# Altium schematic sheet UNITED.SchDoc
size A1
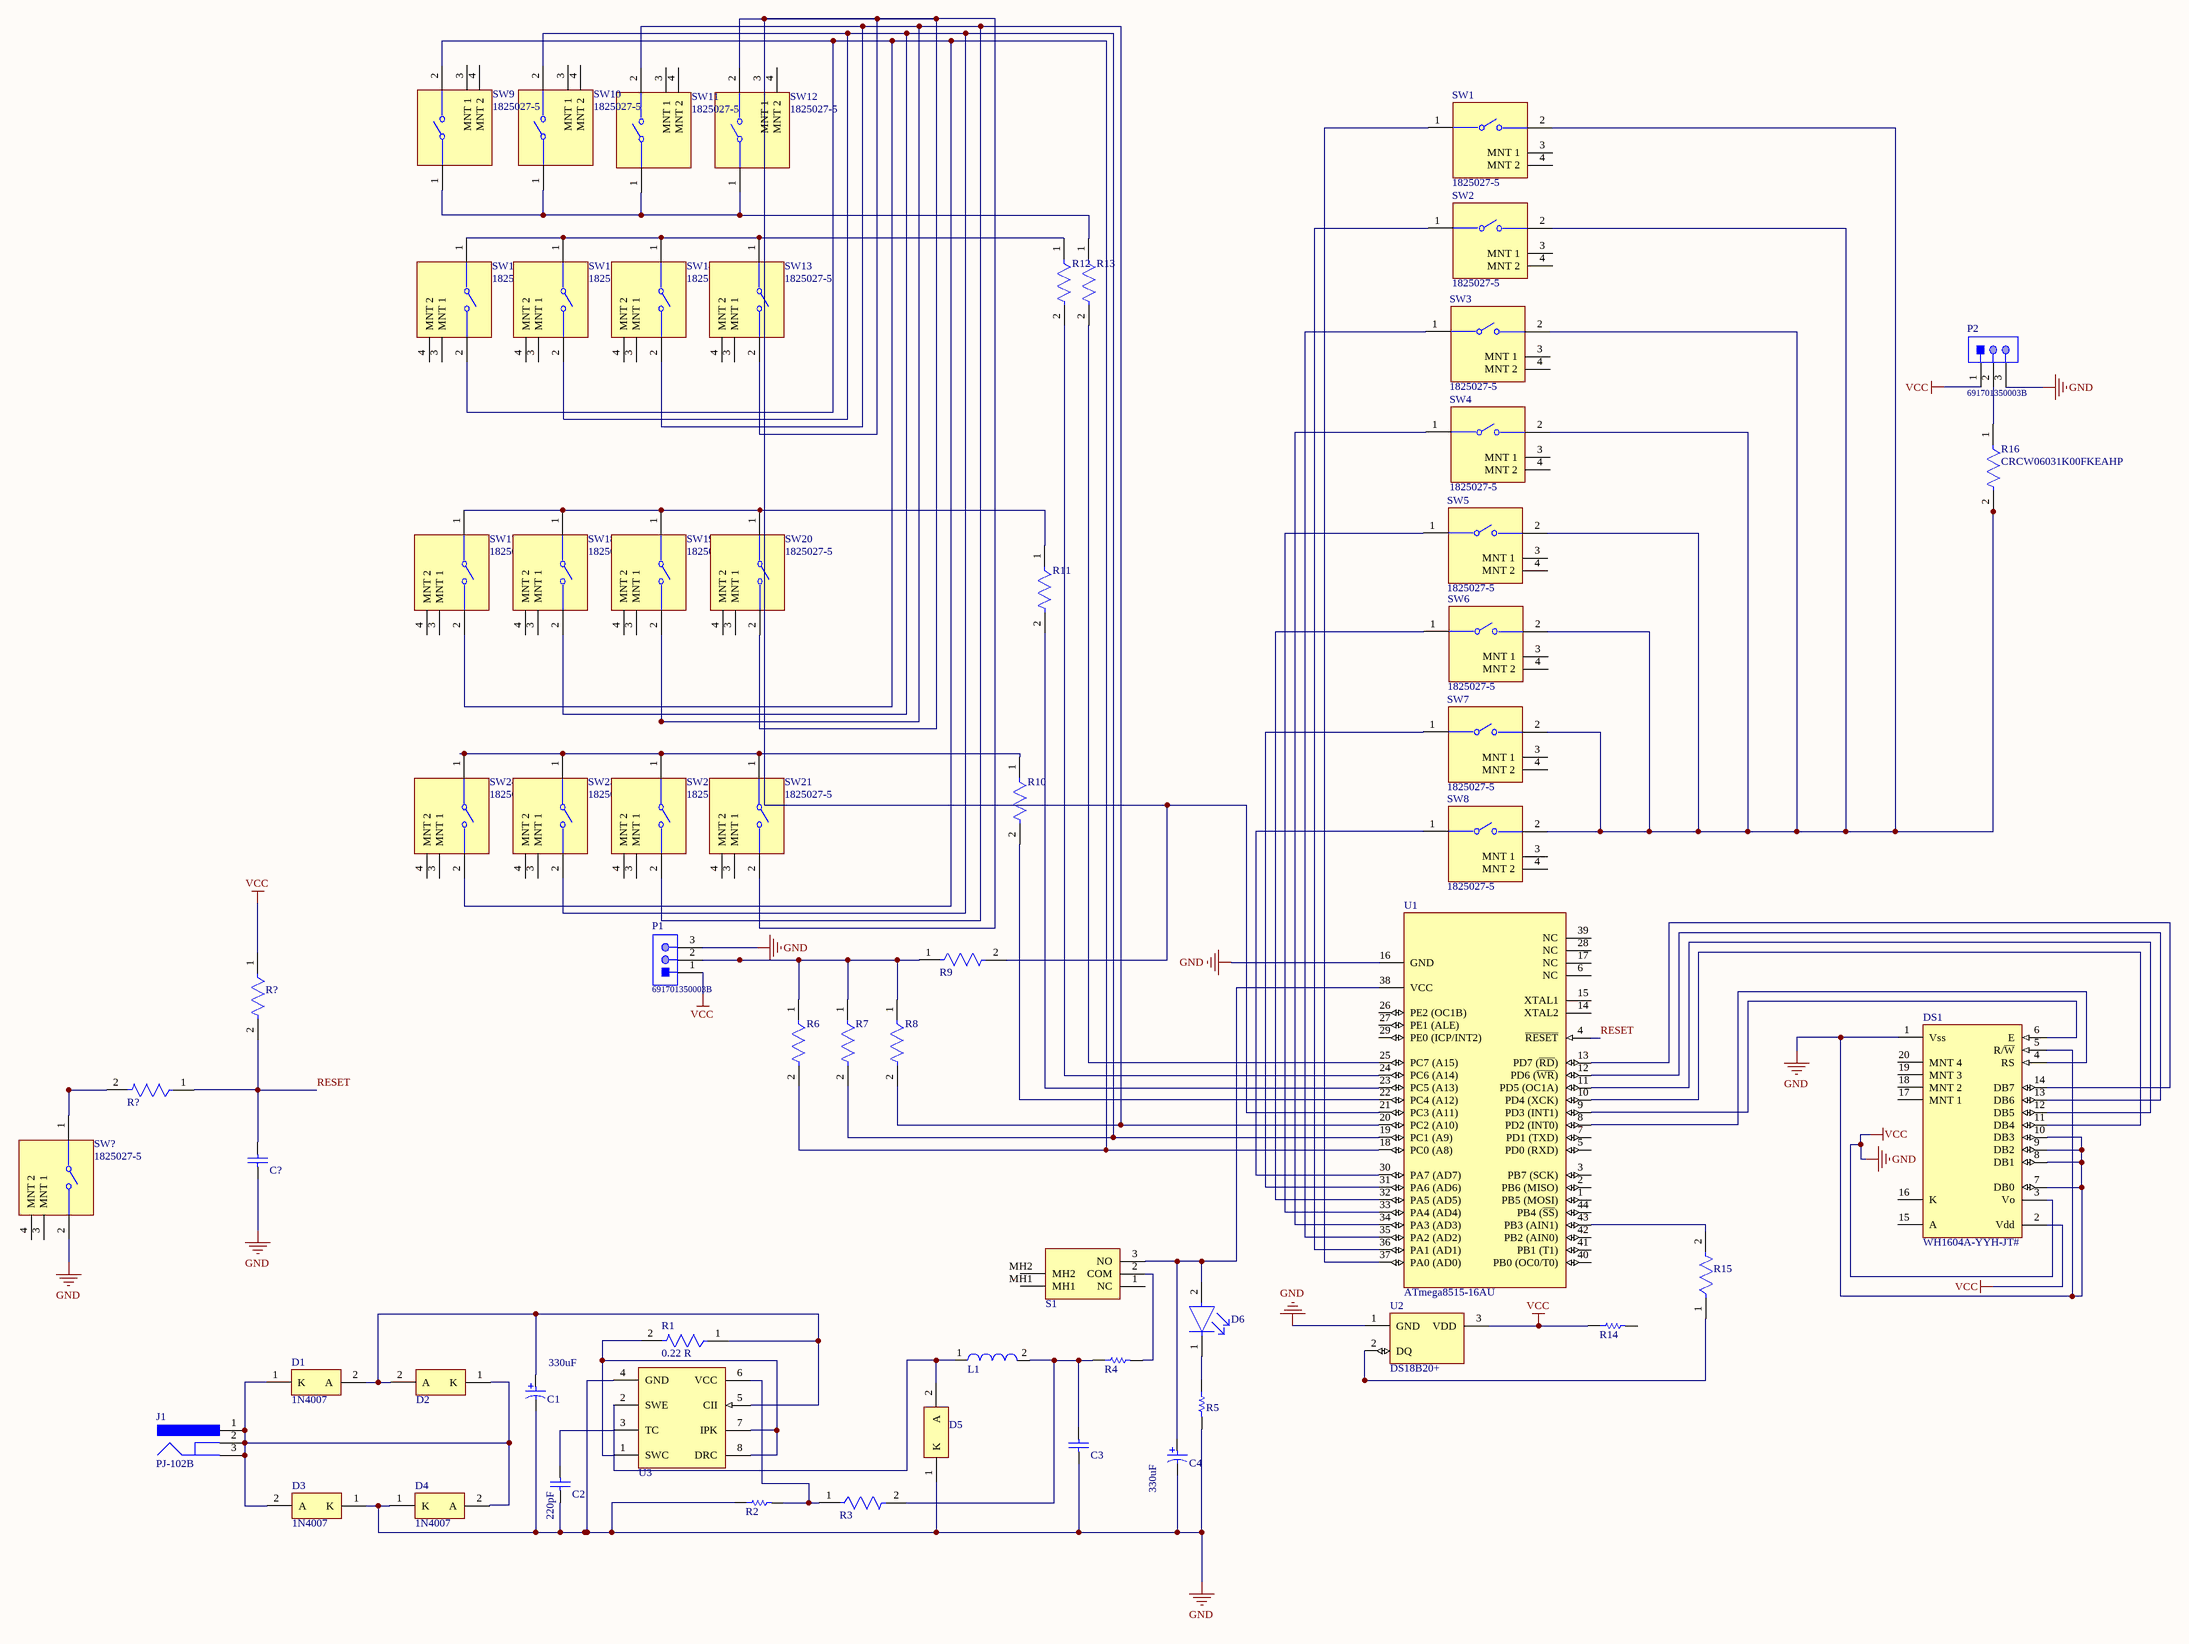
[diagram p0: UNITED.SchDoc]

## Parts
(Parts that share a designator on the sheet are numbered #1, #2 ... from top to bottom, then left to right.)
C1  EEE-FK1V331P  [PNSC-EEE-FK1V331P_L]  (value not drawn)
C2  VJ0603D201KXAAJ  [CAPC1608X92X38LL15T08]  (value not drawn)
C3  GRM188R60J106ME47D  [CAPC1608X90X35NL10T15]  (value not drawn)
C4  EEE-FK1V331P  [PNSC-EEE-FK1V331P_L]  (value not drawn)
C?  GRM188R60J106ME47D  [CAPC1608X90X35NL10T15]  (value not drawn)
D1  1N4007  [ONSC-AXIAL_LEAD-2-59-10_P]
D2  1N4007  [ONSC-AXIAL_LEAD-2-59-10_P]  (value not drawn)
D3  1N4007  [ONSC-AXIAL_LEAD-2-59-10_P]
D4  1N4007  [ONSC-AXIAL_LEAD-2-59-10_P]
D5  MBRS140T3G  [ONSC-SMB-2-403A-03_H_V]  (value not drawn)
D6  LTST-C190GKT  [FP-LTST-C190GKT-MFG]  (value not drawn)
DS1  WH1604A-YYH-JT#  [FP-WH1604A-YYH-JT#-MFG]
J1  PJ-102B  [CUI-PJ-102B_V]
L1  744774222  [WE-PD2-M]  (value not drawn)
P1  691701350003B  [691701350003B]
P2  691701350003B  [691701350003B]
R1  Resistance: 0.22 R  [FP-CRCW0402-e3-IPC_C]  (hidden comment: CRCW04022K70FKED)
R2  CRCW08051K00FKEA  [RESC2013X50X30NL20T20]  (value not drawn)
R3  CRCW06033K00FKEA  [FP-CRCW0603-e3-MFG]  (value not drawn)
R4  Jumper 2512(6432)  [RESC2512(6432)_L]  (value not drawn)
R5  RC0402FR-072K2L  [RESC1005X40X25NL05T10]  (value not drawn)
R6  CRCW06031K00FKEAHP  [FP-CRCW0603-HPe3-MFG]  (value not drawn)
R7  CRCW06031K00FKEAHP  [FP-CRCW0603-HPe3-MFG]  (value not drawn)
R8  CRCW06031K00FKEAHP  [FP-CRCW0603-HPe3-MFG]  (value not drawn)
R9  CRCW06031K00FKEAHP  [FP-CRCW0603-HPe3-MFG]  (value not drawn)
R10  CRCW06031K00FKEAHP  [FP-CRCW0603-HPe3-MFG]  (value not drawn)
R11  CRCW06031K00FKEAHP  [FP-CRCW0603-HPe3-MFG]  (value not drawn)
R12  CRCW06031K00FKEAHP  [FP-CRCW0603-HPe3-MFG]  (value not drawn)
R13  CRCW06031K00FKEAHP  [FP-CRCW0603-HPe3-MFG]  (value not drawn)
R14  CRCW08051K00FKEA  [RESC2013X50X30NL20T20]  (value not drawn)
R15  CRCW08050000Z0EAHP  [FP-CRCW0805-HPe3-IPC_A]  (value not drawn)
R16  CRCW06031K00FKEAHP  [FP-CRCW0603-HPe3-MFG]
R?#1  CRCW06031K00FKEAHP  [FP-CRCW0603-HPe3-MFG]  (value not drawn)
R?#2  CRCW06031K00FKEAHP  [FP-CRCW0603-HPe3-MFG]  (value not drawn)
S1  MS12ASW40  [MS12ASW40]  (value not drawn)
SW1  1825027-5  [FP-1825027-5-0]
SW2  1825027-5  [FP-1825027-5-0]
SW3  1825027-5  [FP-1825027-5-0]
SW4  1825027-5  [FP-1825027-5-0]
SW5  1825027-5  [FP-1825027-5-0]
SW6  1825027-5  [FP-1825027-5-0]
SW7  1825027-5  [FP-1825027-5-0]
SW8  1825027-5  [FP-1825027-5-0]
SW9  1825027-5  [FP-1825027-5-0]
SW10  1825027-5  [FP-1825027-5-0]
SW11  1825027-5  [FP-1825027-5-0]
SW12  1825027-5  [FP-1825027-5-0]
SW13  1825027-5  [FP-1825027-5-0]
SW14  1825027-5  [FP-1825027-5-0]
SW15  1825027-5  [FP-1825027-5-0]
SW16  1825027-5  [FP-1825027-5-0]
SW17  1825027-5  [FP-1825027-5-0]
SW18  1825027-5  [FP-1825027-5-0]
SW19  1825027-5  [FP-1825027-5-0]
SW20  1825027-5  [FP-1825027-5-0]
SW21  1825027-5  [FP-1825027-5-0]
SW22  1825027-5  [FP-1825027-5-0]
SW23  1825027-5  [FP-1825027-5-0]
SW24  1825027-5  [FP-1825027-5-0]
SW?  1825027-5  [FP-1825027-5-0]
U1  ATmega8515-16AU  [44A_N]
U2  DS18B20+  [Q3+1]
U3  MC34063ACD-TR  [SO8_M]  (value not drawn)

## Nets
GND: C1.2 C2.1 C3.1 C4.2 C?.1 D3.1(K) D4.1(K) D5.1(K) DS1.1(Vss) DS1.2(Vdd) DS1.3(Vo) DS1.5(R/~{W}) DS1.7(DB0) DS1.8(DB1) DS1.9(DB2) DS1.10(DB3) P1.1 P1.3 P2.1 P2.3 R2.1 R5.2 R14.1 R?#1.1 SW?.2 U1.16(GND) U2.1(GND) U2.3(VDD) U3.4(GND)  [also labelled VCC]
RESET: C?.2 R?#1.2 R?#2.1 U1.4(~{RESET})
NetC1_1: C1.1 D1.2(A) D2.2(A) R1.1 U3.5(CII)
NetC2_2: C2.2 U3.3(TC)
NetC3_2: C3.2 L1.2 R3.2 R4.1
NetC4_1: C4.1 D6.2(A) S1.3(NO) U1.38(VCC)
NetD1_1: D1.1(K) D2.1(K) D3.2(A) J1.1 J1.2 J1.3
NetD5_2: D5.2(A) L1.1 U3.2(SWE)
NetD6_1: D6.1(C) R5.1
NetDS1_4: DS1.4(RS) U1.8(PD2_(INT0))
NetDS1_6: DS1.6(E) U1.9(PD3_(INT1))
NetDS1_11: DS1.11(DB4) U1.10(PD4_(XCK))
NetDS1_12: DS1.12(DB5) U1.11(PD5_(OC1A))
NetDS1_13: DS1.13(DB6) U1.12(PD6_(~{WR}))
NetDS1_14: DS1.14(DB7) U1.13(PD7_(~{RD}))
NetP1_2: P1.2 R6.1 R7.1 R8.1 R9.1
NetP2_2: P2.2 R16.1
NetR1_2: R1.2 U3.1(SWC) U3.7(IPK) U3.8(DRC)
NetR2_2: R2.2 R3.1 U3.6(VCC)
NetR4_2: R4.2 S1.2(COM)
NetR6_2: R6.2 SW9.2 SW16.2 SW17.2 SW24.2 U1.18(PC0_(A8))
NetR7_2: R7.2 SW10.2 SW15.2 SW18.2 SW23.2 U1.19(PC1_(A9))
NetR8_2: R8.2 SW11.2 SW14.2 SW19.2 SW22.2 U1.20(PC2_(A10))
NetR9_2: R9.2 SW12.2 SW12.3(MNT_1) SW13.2 SW20.2 SW21.2 U1.21(PC3_(A11))
NetR10_1: R10.1 SW21.1 SW22.1 SW23.1 SW24.1
NetR10_2: R10.2 U1.22(PC4_(A12))
NetR11_1: R11.1 SW17.1 SW18.1 SW19.1 SW20.1
NetR11_2: R11.2 U1.23(PC5_(A13))
NetR12_1: R12.1 SW13.1 SW14.1 SW15.1 SW16.1
NetR12_2: R12.2 U1.24(PC6_(A14))
NetR13_1: R13.1 SW9.1 SW10.1 SW11.1 SW12.1
NetR13_2: R13.2 U1.25(PC7_(A15))
NetR15_1: R15.1 U2.2(DQ)
NetR15_2: R15.2 U1.43(PB3_(AIN1))
NetR16_2: R16.2 SW1.2 SW2.2 SW3.2 SW4.2 SW5.2 SW6.2 SW7.2 SW8.2
NetR?#2_2: R?#2.2 SW?.1
NetSW1_1: SW1.1 U1.37(PA0_(AD0))
NetSW2_1: SW2.1 U1.36(PA1_(AD1))
NetSW3_1: SW3.1 U1.35(PA2_(AD2))
NetSW4_1: SW4.1 U1.34(PA3_(AD3))
NetSW5_1: SW5.1 U1.33(PA4_(AD4))
NetSW6_1: SW6.1 U1.32(PA5_(AD5))
NetSW7_1: SW7.1 U1.31(PA6_(AD6))
NetSW8_1: SW8.1 U1.30(PA7_(AD7))

Not connected (* = marked no-connect by the designer): D4 2(A); DS1 15(A) 16(K) 17(MNT_1) 18(MNT_2) 19(MNT_3) 20(MNT_4); R14 2; S1 1(NC) MH1 MH2; SW1 3(MNT_1) 4(MNT_2); SW2 3(MNT_1) 4(MNT_2); SW3 3(MNT_1) 4(MNT_2); SW4 3(MNT_1) 4(MNT_2); SW5 3(MNT_1) 4(MNT_2); SW6 3(MNT_1) 4(MNT_2); SW7 3(MNT_1) 4(MNT_2); SW8 3(MNT_1) 4(MNT_2); SW9 3(MNT_1) 4(MNT_2); SW10 3(MNT_1) 4(MNT_2); SW11 3(MNT_1) 4(MNT_2); SW12 4(MNT_2); SW13 3(MNT_1) 4(MNT_2); SW14 3(MNT_1) 4(MNT_2); SW15 3(MNT_1) 4(MNT_2); SW16 3(MNT_1) 4(MNT_2); SW17 3(MNT_1) 4(MNT_2); SW18 3(MNT_1) 4(MNT_2); SW19 3(MNT_1) 4(MNT_2); SW20 3(MNT_1) 4(MNT_2); SW21 3(MNT_1) 4(MNT_2); SW22 3(MNT_1) 4(MNT_2); SW23 3(MNT_1) 4(MNT_2); SW24 3(MNT_1) 4(MNT_2); SW? 3(MNT_1) 4(MNT_2); U1 1(PB5_(MOSI)) 2(PB6_(MISO)) 3(PB7_(SCK)) 5(PD0_(RXD)) 6(NC) 7(PD1_(TXD)) 14(XTAL2) 15(XTAL1) 17(NC) 26(PE2_(OC1B)) 27(PE1_(ALE)) 28(NC) 29(PE0_(ICP/INT2)) 39(NC) 40(PB0_(OC0/T0)) 41(PB1_(T1)) 42(PB2_(AIN0)) 44(PB4_(~{SS}))

## Notes on the sheet
- (near C1) 330uF
- (near C2) 220pF
- (near C4) 330uF

## Library data of the parts
C1 C4 = CMP-2000-06212-1: Aluminum Electrolytic Capacitor, 330 uF, 35 V, -55 to 105 degC, 2-Pin CAPAE, RoHS, Tape and Reel; Manufacturer: Panasonic; Capacitance: 330µF; Type: Can; Impedance: 0.08O; Ripple Current: 850mA; Lifetime@Temperature: 2000Hrs@105°C; Rated Voltage: 35V; Datasheet Version: 07/2008; Manufacturer URL: http://www.panasonic.com/; Package Description: 2-Pin Capacitor Aluminum Electrolytic, Body 10.3 x 10.3 mm, Height 10.5 mm; Case Size/Dimension: Ø10x10.2mm; Datasheet URL: https://datasheet.ciiva.com/29313/443481-da-01-en-smd-elko-vfk-g-330-uf-35v-29313592.pdf; Series: FK; Mounting Technology: SurfaceMount; Package Reference: EEE-FK1V331P; Operating Temp-Max: 105°C; Operating Temp Range: -55to+105°C
C2 = CMP-2006-01502-1: Manufacturer: Vitramon; Part Number: VJ0603D201KXAAJ
C3 C? = CMP-2006-02792-1: Manufacturer: Murata; Part Number: GRM188R60J106ME47D
D1-D4 = CMP-0902-00142-1: Standard Recovery Rectifier, 2-Pin Axial_Lead, Pb-Free, Bulk Bag; Manufacturer: On Semiconductor; IO(rec) Max (A): 1; IFSM Max (A): 30; VRRM Max (V): 1000; ComponentLink3URL: http://www.onsemi.cn/pub_link/Collateral/59-10.PDF; PackageVersion: Rev. U, 02/2005; PackageDescription: 2-Pin, Axial Lead, Diameter 2.35 mm; PackageReference: AXIAL_LEAD-2-59-10; RoHS: TRUE; PartNumber: 1N4007; Packing: Bulk Bag; DatasheetVersion: Rev. 13; ComponentLink3Description: Package Specification; ComponentLink1Description: Manufacturer URL; ComponentLink2URL: http://www.onsemi.com/pub_link/Collateral/1N4001-D.PDF; ComponentLink1URL: http://www.onsemi.com/; Type: Standard Recovery; ComponentLink2Description: Datasheet; Mounting Technology: Through Hole
D5 = CMP-1055-00347-1: Schottky Power Rectifier, 2-Pin SMB, Pb-Free, Tape and Reel; Manufacturer: On Semiconductor; Configuration: Single; IFSM Max (A): 40; PackageDescription: 2-Pin Small Molded Package, J-Bend Lead, Body 4.33 x 3.625 mm; PartNumber: MBRS140T3G; PackageReference: SMB-2-403A-03_H; ComponentLink1URL: http://www.onsemi.com/; ComponentLink2URL: http://www.onsemi.cn/pub_link/Collateral/MBRS140T3-D.PDF; PackageVersion: Rev. H, 05/2011; ComponentLink3URL: http://www.onsemi.com/pub_link/Collateral/1SMB5913BT3-D.PDF; Packing: Tape and Reel; ComponentLink1Description: Manufacturer URL; DatasheetVersion: Rev. 9; Mounting Technology: Surface Mount; RoHS: TRUE; ComponentLink3Description: Package Specification; ComponentLink2Description: Datasheet
D6 = CMP-22017-000005-2: LED GREEN CLEAR CHIP SMD; Dominant Wavelength: 569nm; Reverse Voltage: 5V; Lens Color: Colorless; Viewing Angle: 130°; Voltage: 2V; Forward Current: 30mA; Power Dissipation: 100mW; Luminous Intensity: 6mcd; Number of LEDs: 1; Forward Voltage: 2.1V; Wavelength: 565nm; Test Current: 10mA; Min Operating Temperature: -55°C; Lens Style: Clear; Mount: Surface Mount; Width: 0.8mm; Packaging: Tape and Reel; Lens Transparency: Clear; Case Code (Metric): 1608; Depth: 0.8mm; Case Code (Imperial): 0603; Case/Package: 0603; Number of Pins: 2; Max Operating Temperature: 85°C; Lead Free: Lead Free; Number of Elements: 1; Length: 1.6mm; Height: 0.8mm; Package Quantity: 1; Power Rating: 100mW; Radiation Hardening: No; Illumination Color: Green; Color: Green
DS1 = CMP-249946-000001-1: Winstar WH1604A-YYH-JT 16x4 LCD Display Yellow/green LED Backlight; Max Supply Voltage: 5.5V; Forward Voltage: 4.2V; Min Supply Voltage: 4.5V; Wavelength: 575nm; Number Of Characters: 64; Colour: Green; Viewing Angle: 80/60°; Display Type: DOT Matrix; Interface: Parallel; Luminous Intensity: 150000mcd; Forward Current: 220mA; RoHS: TRUE; Manufacturer Part Number: WH1604A-YYH-JT#; Device Class L3: LCD; Manufacturer: Winstar; ComponentLink2URL: https://static.rapidonline.com/pdf/57-2240.pdf; Device Class L2: Displays; Height: 13.6mm; Device Class L1: Optoelectronics; Package: 0; Temperature Range High: +70°C; Temperature: -20°C to +70°C; Lead Free: Yes; ComponentLink2Description: Datasheet; Octopart: https://octopart.com/wh1604a-yyh-jt%23-winstar-55771695; Category: Disp; Temperature Range Low: -20°C; Automotive: No
J1 = CMP-2000-06900-1: Through Hole Right Angle DC Power Jack, 2.5 A, 2.5 mm Center Pin, 3 Position, -25 to 85 degC, RoHS, Bulk; Manufacturer: CUIInc.; Insulation Resistance: 100MOhms; Inside Contact Diameter: 2.5mm; Outside Contact Diameter: 6.5mm; Voltage Rating: 24V; Current Rating: 2.5A; Brand: CUI; Datasheet URL: http://www.cui.com/product/resource/pj-102b.pdf; Housing Material: PolybutyleneTerephthalate(PBT); Operating Temperature Range: -25Cto+85C; Package Reference: PJ-102B; Factory Pack Quantity: 280; RoHS: True; Contact Material: Copper; Datasheet Version: Rev. 1.03, 04/2016; Product: Jacks; Mounting Angle: Right; Mounting Style: ThroughHole; Flammability Rating: UL94V-0; Product Category: DCPowerConnectors; Contact Gender: Male; Termination Style: ThroughHole; Manufacturer URL: http://www.cui.com/; Mounting Technology: ThroughHole; Package Description: 3-Pin Through Hole Device, Body 14.4 x 9 mm, Height 11 mm; Contact Plating: Nickel; Packaging: Bulk; Connector Type: DCPowerJack
L1 = CMP-0227-00435-1: SMD Power Inductor WE-PD2, L = 220 µH; Inductance: 220 ÂµH; ComponentLink1URL: http://www.we-online.com; ComponentLink1Description: Manufacturer Link; ComponentLink2Description: Datasheet; PackageReference: WE-PD2-M; ComponentLink2URL: http://www.we-online.de/katalog/media/pdf/744774222.pdf; PackageDescription: SMD Inductor, 2-Leads, Body 5.8 x 5.2 mm; DatasheetVersion: ver 2, Jun-2005; PackageVersion: 2005
P1 P2 = CMP-1502-02015-1: Serie 7013 B - 3.81mm Horizontal PCB Header THR Type with Flanges WR-TBL, 3 pin; Manufacturer: Wurth Elektronik; Gender: Male; Pin Number: 3; Part Number: 691701350003B; Manufacturer URL: http://www.we-online.de; Package Reference: 691701350003B; Mounting Technology: SMT; Datasheet URL: http://katalog.we-online.de/em/datasheet/6917013500xxB.pdf; Pitch: 3.81mm; Publisher: WurthElektronik; Packaging: TapeandReel; Operating Temperature: -40to105degC
R1 = CMP-2002-08466-2: RES Thick Film, 0.22 Ω, 1%, 0.063W, 100ppm/°C, 0402; Power Rating: 63mW; Voltage Rating (DC): 50V; Termination: SMD/SMT; Composition: Thick Film; Packaging: Tape and Reel; Tolerance: 1%; Number of Pins: 2; Contact Plating: Tin; Max Operating Temperature: 155°C; Depth: 0.5mm; Features: Automotive AEC-Q200; Lead Free: Lead Free; Number of Terminations: 2; Case/Package: 0402; Max Power Dissipation: 63mW; Radiation Hardening: No; Height: 0.35mm; Min Operating Temperature: -55°C; Width: 0.02inch; Military Standard: Not; Package Quantity: 10; Weight: 2.3E-05oz; Temperature Coefficient: 100ppm/°C; Case Code (Metric): 1005; Voltage Rating: 50V; Length: 1mm; Case Code (Imperial): 0402
R2 R14 = CMP-1013-00510-2: Manufacturer: Vishay Dale; Part Number: CRCW08051K00FKEA
R3 = CMP-2000-03293-2: RES Thick Film, 3kΩ, 1%, 0.1W, 100ppm/°C, 0603; Voltage Rating: 75V; Resistance: 3kR; Power Rating: 100mW; Features: Automotive AEC-Q200; Radiation Hardening: No; Contact Plating: Tin; Termination: SMD/SMT; Lead Free: Lead Free; Case Code (Imperial): 0603; Case Code (Metric): 1608; Case/Package: 0603; Depth: 0.85mm; Mount: Surface Mount; Voltage Rating (DC): 75V; Tolerance: 1%; Package Quantity: 10; Temperature Coefficient: 100ppm/°C; Height: 0.45mm; Max Power Dissipation: 100mW; Composition: Thick Film; Max Operating Temperature: 155°C; Military Standard: Not; Weight: 7.1E-05oz; Length: 1.55mm; Packaging: Tape and Reel; Number of Terminations: 2; Width: 0.85mm; Min Operating Temperature: -55°C
R4 = CMP-1018-00001-1: Jumper 2512 (6432 Metric); Tolerance: None; Case-EIA: 2512; Value: 0.00 Ohm; Case-Metric: 6432; Technology: SMT; Power: None
R5 = CMP-2002-07567-1: Manufacturer: Yageo / Phycomp; Part Number: RC0402FR-072K2L
R6-R13 R16 R?#1 R?#2 = CMP-2000-02970-2: RES Thick Film, 1kΩ, 1%, 0.33W, 100ppm/°C, 0603; Max Power Dissipation: 250mW; Voltage Rating (DC): 75V; Resistance: 1kR; Number of Terminations: 2; Min Operating Temperature: -55°C; Contact Plating: Tin; Termination: SMD/SMT; Weight: 7.1E-05oz; Height: 0.45mm; Radiation Hardening: No; Package Quantity: 10; Case Code (Imperial): 0603; Packaging: Tape and Reel; Max Operating Temperature: 155°C; Case/Package: 0603; Lead Free: Lead Free; Military Standard: Not; Mount: Surface Mount; Power Rating: 250mW; Length: 1.6mm; Features: Automotive AEC-Q200; Number of Pins: 2; Voltage Rating: 75V; Temperature Coefficient: 100ppm/°C; Depth: 0.85mm; Tolerance: 1%; Composition: Thick Film; Width: 0.8mm; Case Code (Metric): 1608
R15 = CMP-2001-04185-2: RES Thick Film, 0Ω, 0.5W, 0805; Resistance: 0mR; Max Power Dissipation: 500mW; Power Rating: 330mW; Voltage Rating (DC): 150V; Temperature Coefficient: 0ppm/°C; Tolerance: 5%; Min Operating Temperature: -55°C; Features: Automotive AEC-Q200; Weight: 0.000194oz; Case Code (Metric): 2012; Package Quantity: 5000; Packaging: Tape and Reel; Height: 0.024inch; Composition: Thick Film; Case Code (Imperial): 0805; Military Standard: Not; Number of Pins: 2; Termination: Solder; Lead Free: Lead Free; Max Operating Temperature: 155°C; Radiation Hardening: No; Voltage Rating: 150V; Width: 0.049inch; Number of Terminations: 2; Contact Plating: Tin; Length: 2mm; Depth: 1.25mm; Case/Package: 0805; REACH SVHC: No SVHC; Mount: Surface Mount
S1 = MS12ASW40: Switch; Manufacturer_Name: NKK Switches; Datasheet Link: https://www.nkkswitches.de/products/Slides/Slides%20MS/MS12ASW40/; Height: 12.7mm; Manufacturer_Part_Number: MS12ASW40; Arrow Part Number: MS12ASW40; Arrow Price/Stock: https://www.arrow.com/en/products/ms12asw40/nkk-switches; Mouser Part Number: 633-MS12ASW40; Mouser Price/Stock: https://www.mouser.com/Search/Refine.aspx?Keyword=633-MS12ASW40
SW1-SW24 SW? = CMP-2000-05514-2: SWITCH TACTILE SPST-NO 0.05A 24V; Manufacturer: TE Connectivity; Contact Current Rating: 50mA; Contact Resistance: 100mΩ; Electromechanical Life: 100000Cycles; Operating Force: 160gf; Throw Configuration: SPST-NO; Lead Free: Yes; Digikey Description: SWITCH TACTILE SPST-NO 0.05A 24V; ComponentLink2Description: Datasheet; Height: 7.31mm; ComponentLink2URL: https://www.te.com/commerce/DocumentDelivery/DDEController?Action=showdoc&DocId=Customer+Drawing%7F1825027%7FG4%7Fpdf%7FEnglish%7FENG_CD_1825027_G4.pdf%7F1825027-5; Mount: Through Hole; Temperature Range High: +85°C; Temperature: -35°C to +85°C; RoHS: TRUE; Device Class L3: Pushbutton Switches; Package: 1825027-5; Temperature Range Low: -35°C; Category: Switch; Automotive: No; Octopart: https://octopart.com/1825027-5-te+connectivity-46510878; Mouser Description: Tactile Switches R/A TACT 160G PB SWITCH; Manufacturer Part Number: 1825027-5; Voltage Rating Dc: 24V; Device Class L2: Switches; Device Class L1: Electromechanical
U1 = CMP-0095-00300-3: 8-bit AVR Microcontroller, 8KB Flash, 512 Bytes EEPROM, 512 Bytes SRAM, 4.5-5.5V, 44-pin TQFP, Industrial Grade (-40°C to 85°C); ComponentLink2URL: http://www.atmel.com/dyn/resources/prod_documents/doc2512.pdf; PackageReference: 44A; DatasheetVersion: revK, Jan-2010; ComponentLink1URL: http://www.atmel.com/; PackageDescription: 44-Pin Plastic Thin Profile Quad Flat Pack, 10 x 10 x 1.0 mm Body, 0.8 mm Pitch (TQFP); Code_JEDEC: MS-026-ACB; RevisionNote: Re-linked to correct symbol; PackageVersion: revC, Oct-2010; ComponentLink3URL: http://www.atmel.com/dyn/resources/prod_documents/2512S.pdf; ComponentLink2Description: ATmega8515(L) Datasheet; ComponentLink3Description: ATmega8515(L) Summary; ComponentLink1Description: Manufacturer URL
U2 = CMP-0253-00003-1: Programmable Resolution Digital Thermometer, 1-Wire Interface, ±0.5°C Accuracy, 3-Pin TO92, -55°C to +125°C, Pb-Free; ComponentLink2URL: http://datasheets.maxim-ic.com/en/ds/DS18B20.pdf; PackageReference: Q3+1; ComponentLink1Description: Manufacturer URL; PackageDescription: TO-92 Package, Body Dia. 4.7mm; Leads 0.51 x 0.51 mm (max), Pb-Free; DatasheetVersion: 2007; Code_JEDEC: TO-226-AA; ComponentLink1URL: http://www.maxim-ic.com; PackageVersion: revB, 2009; ComponentLink2Description: Datasheet
U3 = CMP-0241-00016-1: DC/DC converter control circuit, 8-Pin SO, Tape and Reel; Code_IPC: SOIC127P600-8; ComponentLink2Description: Datasheet; ComponentLink3Description: Package Specification; PackageDescription: 8-Pin Small Outline Integrated Circuit 1.27 mm Pitch; Code_JEDEC: MS-012-AA; ComponentLink3URL: http://www.st.com/internet/com/TECHNICAL_RESOURCES/TECHNICAL_LITERATURE/PACKAGE_INFORMATION/CD00004680.pdf; ComponentLink1Description: Manufacturer URL; ComponentLink1URL: http://www.st.com; DatasheetVersion: Nov-2007; ComponentLink2URL: http://www.st.com/internet/com/TECHNICAL_RESOURCES/TECHNICAL_LITERATURE/DATASHEET/CD00001232.pdf; PackageReference: SO8; PackageVersion: Dec-2002